# EAGLE design TESTI2C (EAGLE 6.5.0)
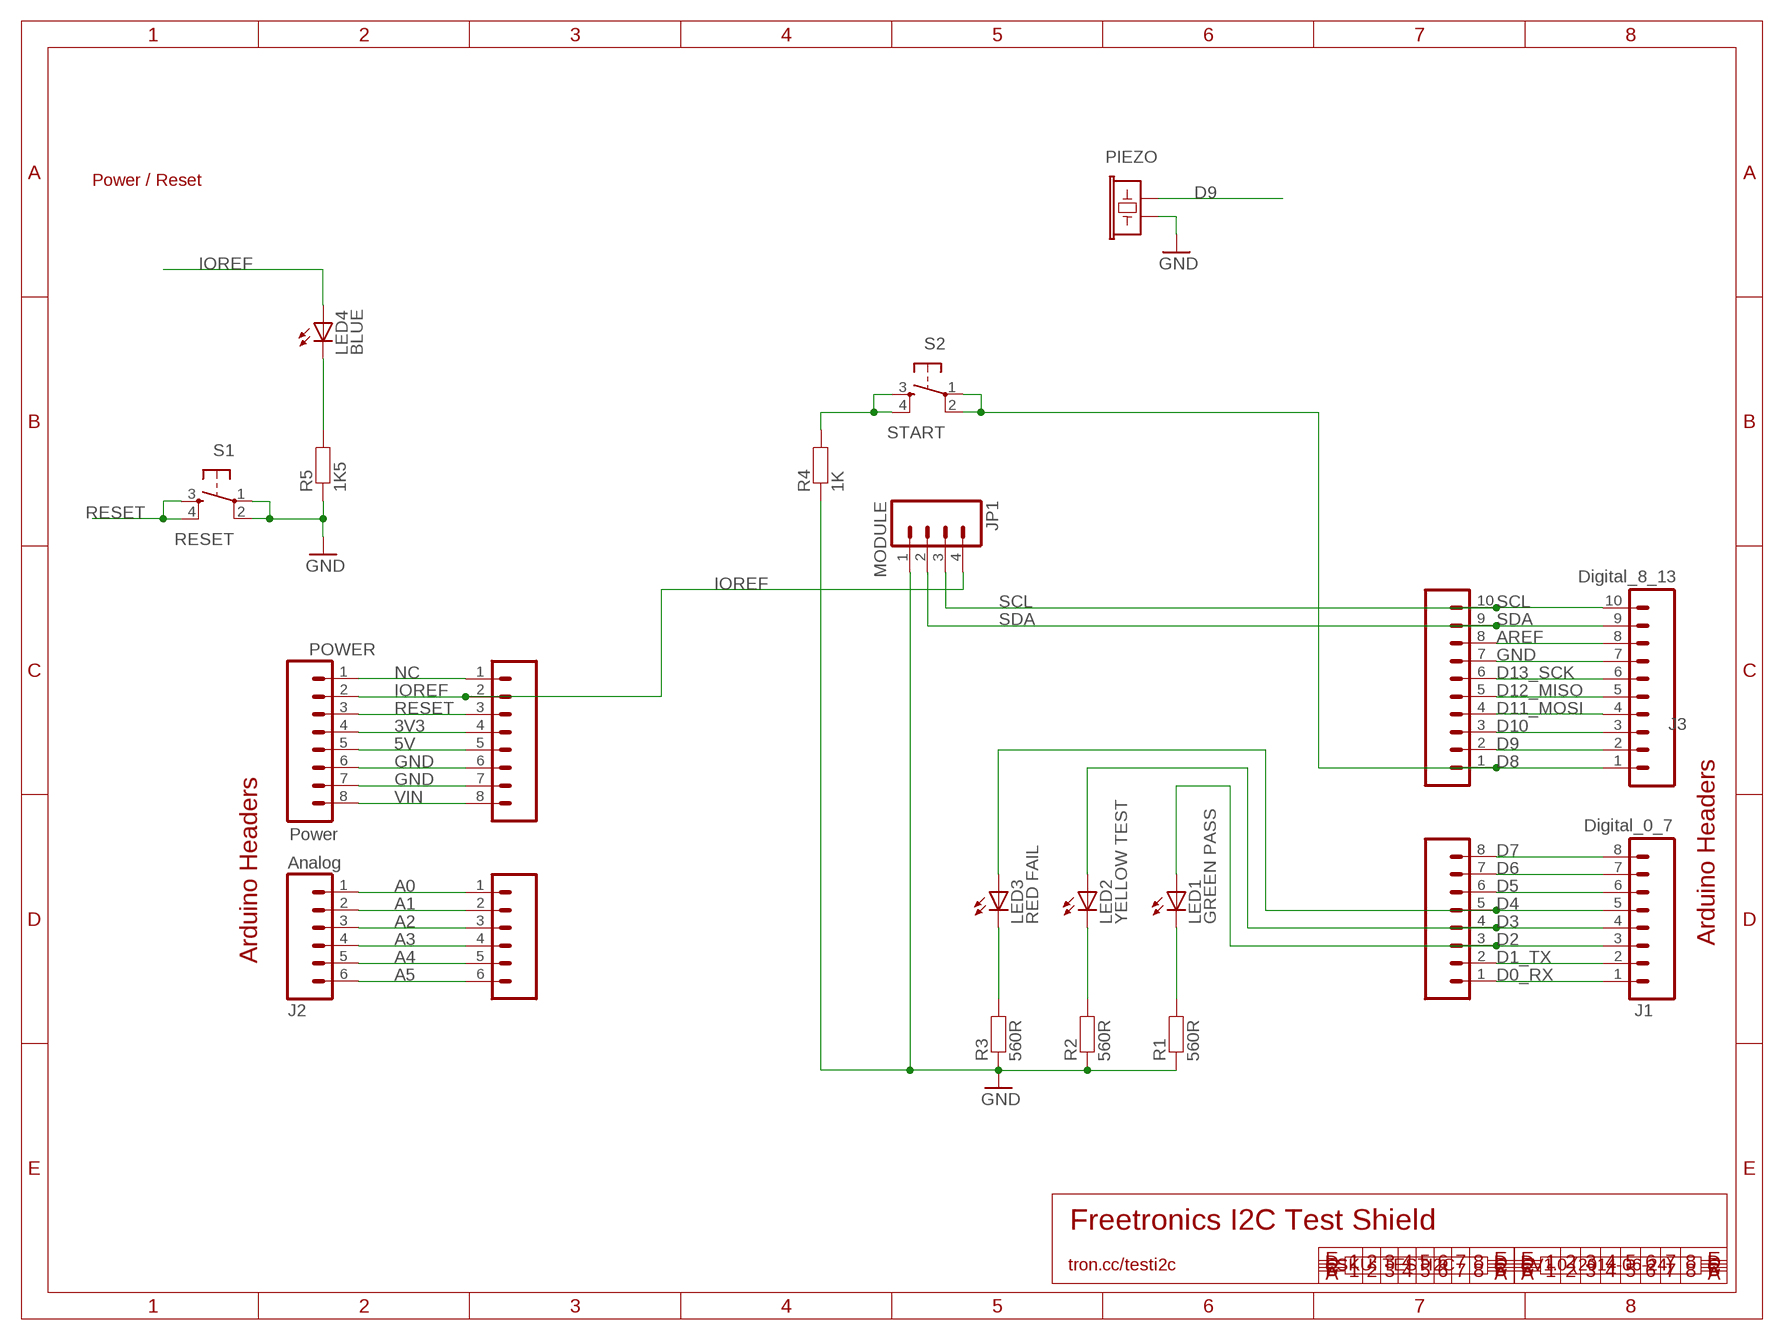
[diagram p0: schematic, sheet 1]

## Parts
J1  Digital_0_7  M08  [1X08]
J2  Analog  M06SIP  [1X06]
J3  Digital_8_13  M100.1  [1X10]
JP1  MODULE  M04PTH  [1X04]
LED1  GREEN PASS  LED0603  [LED-0603]
LED2  YELLOW TEST  LED0603  [LED-0603]
LED3  RED FAIL  LED0603  [LED-0603]
LED4  BLUE  LED0603  [LED-0603]
PIEZO  BUZZERSMD12X12  [BUZZER-12X12-SMT]
POWER  Power  M08  [1X08]
R1  560R  RESISTOR0603  [0603]
R2  560R  RESISTOR0603  [0603]
R3  560R  RESISTOR0603  [0603]
R4  1K  RESISTOR0603  [0603]
R5  1K5  RESISTOR0603  [0603]
S1  RESET  TAC_SWITCHPTH  [TACTILE-PTH]
S2  START  TAC_SWITCHPTH  [TACTILE-PTH]
SL1  Digital_0_7  M08  [1X08]
SL2  Analog  M06SIP  [1X06]
SL3  Digital_8_13  M100.1  [1X10]
SLP  Power  M08  [1X08]

## Nets
3V3: POWER.4 SLP.4
5V: POWER.5 SLP.5
A0: J2.1 SL2.1
A1: J2.2 SL2.2
A2: J2.3 SL2.3
A3: J2.4 SL2.4
A4: J2.5 SL2.5
A5: J2.6 SL2.6
AREF: J3.8 SL3.8
D0_RX: J1.1 SL1.1
D1_TX: J1.2 SL1.2
D2: J1.3 LED1.A SL1.3
D3: J1.4 LED2.A SL1.4
D4: J1.5 LED3.A SL1.5
D5: J1.6 SL1.6
D6: J1.7 SL1.7
D7: J1.8 SL1.8
D8: J3.1 S2.1 S2.2 SL3.1
D9: J3.2 PIEZO.2 SL3.2
D10: J3.3 SL3.3
D11_MOSI: J3.4 SL3.4
D12_MISO: J3.5 SL3.5
D13_SCK: J3.6 SL3.6
GND: J3.7 JP1.1 PIEZO.1 POWER.6 POWER.7 R1.1 R2.1 R3.1 R4.1 R5.1 S1.1 S1.2 SL3.7 SLP.6 SLP.7
IOREF: JP1.4 LED4.A POWER.2 SLP.2
N$1: LED1.C R1.2
N$2: LED2.C R2.2
N$3: LED3.C R3.2
N$4: LED4.C R5.2
N$7: R4.2 S2.3 S2.4
NC: POWER.1 SLP.1
RESET: POWER.3 S1.3 S1.4 SLP.3
SCL: J3.10 JP1.3 SL3.10
SDA: J3.9 JP1.2 SL3.9
VIN: POWER.8 SLP.8

## Notes on the sheet
- Power / Reset
- Arduino Headers
- Arduino Headers
- Freetronics I2C Test Shield
- tron.cc/testi2c | SKU: TESTI2C | V1.0 (2014-06-24)

## Library data of the parts
J1 POWER SL1 SLP = freetronics:M08: Header 8 Standard 8-pin 0.1" header. Use with straight break away headers (SKU : PRT-00116), right angle break away headers (PRT-00553), swiss pins (PRT-00743), machine pins (PRT-00117), and female headers (PRT-00115).
J2 SL2 = freetronics:M06: Header 6 Standard 6-pin 0.1" header. Use with straight break away headers (SKU : PRT-00116), right angle break away headers (PRT-00553), swiss pins (PRT-00743), machine pins (PRT-00117), and female headers (PRT-00115). Molex polarized connector foot print use with SKU : PRT-08094 with associated crimp pins and housings. NOTES ON THE VARIANTS LOCK and LOCK_LONGPADS... This footprint was designed to help hold the alignment of a through-hole component (i.e. 6-pin header) while soldering it into place. You may notice that each hole has been shifted either up or down by 0.005 of an inch from it's more standard position (which is a perfectly straight line). This slight alteration caused the pins (the squares in the middle) to touch the edges of the holes. Because they are alternating, it causes a "brace" to hold the component in place. 0.005 has proven to be the perfect amount of "off-center" position when using our standard breakaway headers. Although looks a little odd when you look at the bare footprint, once you have a header in there, the alteration is very hard to notice. Also, if you push a header all the way into place, it is covered up entirely on the bottom side. This idea of altering the position of holes to aid alignment will be further integrated into the Sparkfun Library for other footprints. It can help hold any component with 3 or more connection pins.
J3 SL3 = freetronics-original:M10: Header 10 Standard 10-pin 0.1" header. Use with straight break away headers (SKU : PRT-00116), right angle break away headers (PRT-00553), swiss pins (PRT-00743), machine pins (PRT-00117), and female headers (PRT-00115).
JP1 = freetronics-master-v1.1:M04: Header 4 Standard 4-pin 0.1" header. Use with straight break away headers (SKU : PRT-00116), right angle break away headers (PRT-00553), swiss pins (PRT-00743), machine pins (PRT-00117), and female headers (PRT-00115). Molex polarized connector foot print use with SKU : PRT-08231 with associated crimp pins and housings.
LED1-LED4 = freetronics-jon:LED: LEDs Standard schematic elements and footprints for 5mm, 3mm, 1206, and 0603 sized LEDs. 5mm - Spark Fun Electronics SKU : COM-00529 (and others)
PIEZO = freetronics-master-v1:BUZZER: Buzzer - Piezo Transducer
R1-R5 = freetronics-jon:RESISTOR: Resistor Basic schematic elements and footprints for 0603, 1206, and PTH 1/10th watt (small) resistors.
S1 S2 = freetronics:TAC_SWITCH: Momentary Switch Button commonly used for reset or general input. Spark Fun Electronics SKU : COM-00097

## Board
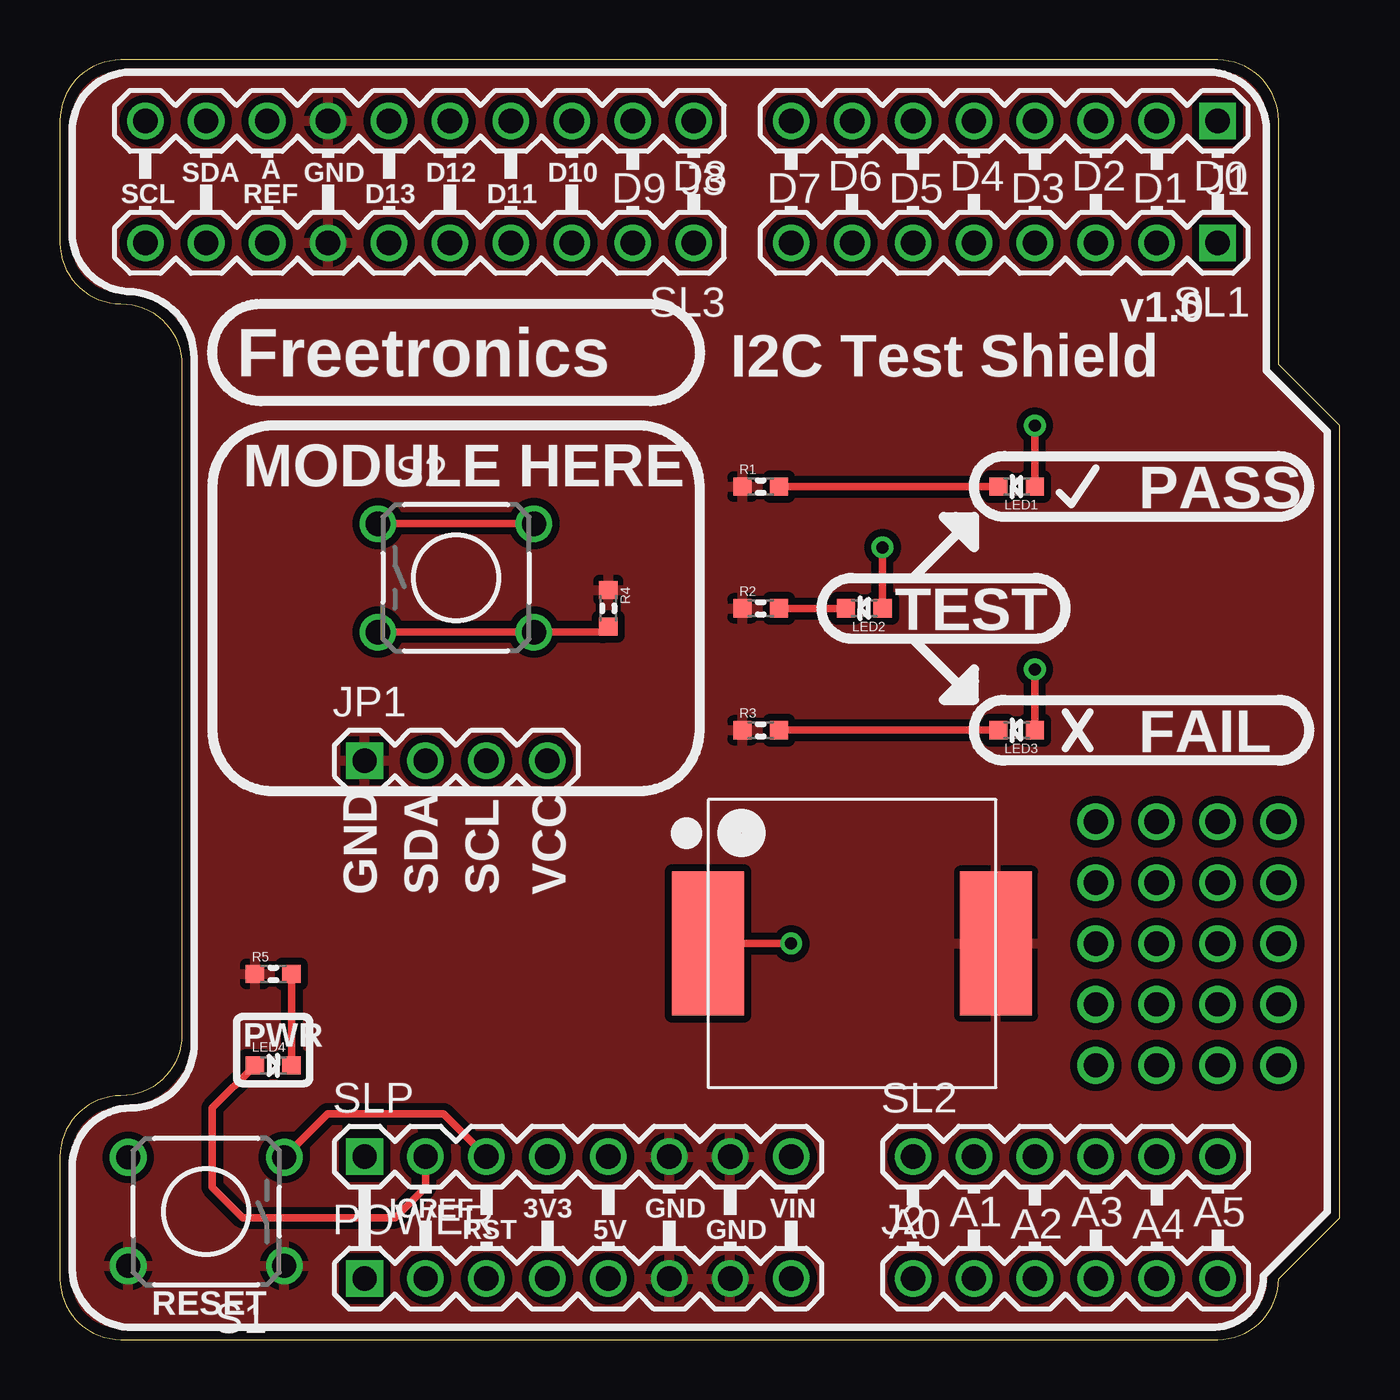
[diagram p1: board, top side]
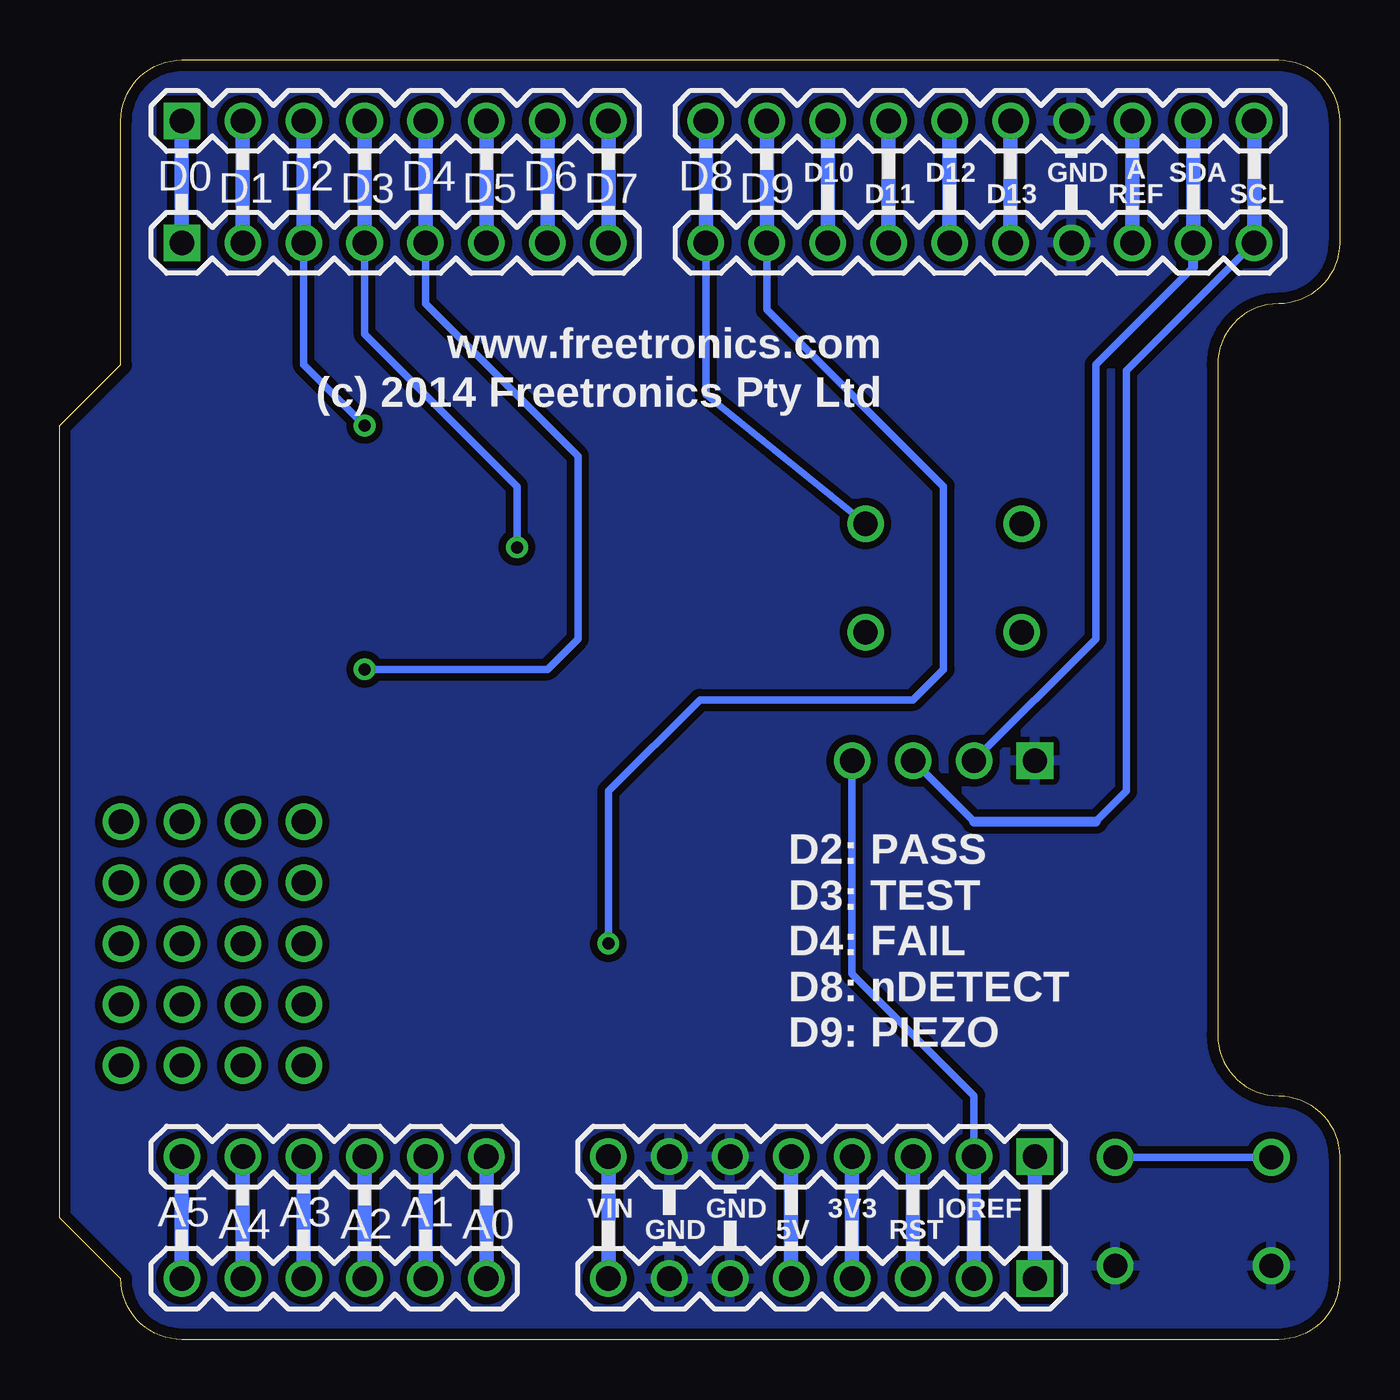
[diagram p2: board, bottom side, seen from below]

Size 53.34 x 53.34 mm. Coordinates in mm from the lower left corner, seen from the top.
Outline: 0,2.54 arc90 2.54,0 48.26,0 arc90 50.8,2.54 53.34,5.08 53.34,38.1 50.8,40.64 50.8,50.8 arc90 48.26,53.34 2.54,53.34 arc90 0,50.8 0,45.72 arc90 2.54,43.18 arc-90 5.08,40.64 5.08,12.7 arc-90 2.54,10.16 arc90 0,7.62 0,2.54
Copper layers (1*16): Top 0.035mm / dielectric 1.5mm / Bottom 0.035mm
Design rules "default *": minimum track width 10mil, minimum drill 24mil, track to track 12mil, track to pad 12mil, pad to pad 12mil, via to via 12mil, smd to smd 8mil, copper to edge 18mil, drill to drill 8mil, minimum pad ring 10mil, minimum via ring 8mil, stop-mask expansion 4mil, vias tented up to drill 0mil, thermal gap 10mil

### Footprints (pad centres in the part's own frame; a part is rotated, then mirrored left to right if it is on the bottom)
1X08 = drill 1.016 square: 1 0,0 | drill 1.016: 2 2.54,0; 3 5.08,0; 4 7.62,0; 5 10.16,0; 6 12.7,0; 7 15.24,0; 8 17.78,0
1X06 = drill 1.016: 1 0,0; 2 2.54,0; 3 5.08,0; 4 7.62,0; 5 10.16,0; 6 12.7,0
1X10 = drill 1.016: 1 0,0; 2 2.54,0; 3 5.08,0; 4 7.62,0; 5 10.16,0; 6 12.7,0; 7 15.24,0; 8 17.78,0; 9 20.32,0; 10 22.86,0
1X04 = drill 1.016 square: 1 0,0 | drill 1.016: 2 2.54,0; 3 5.08,0; 4 7.62,0
LED-0603 = smd 0.762 x 0.762: A -0.762,0; C 0.762,0
BUZZER-12X12-SMT = smd 3 x 6: 1 -6,0; 2 6,0
0603 = smd 0.762 x 0.762: 1 -0.762,0; 2 0.762,0
TACTILE-PTH = drill 1.016: 1 -3.251,2.261; 2 3.251,2.261; 3 -3.251,-2.261; 4 3.251,-2.261

### Placement (x,y rotation side)
J1  48.26,50.8 180 top
J2  35.56,2.54 0 top
J3  26.42,50.8 180 top
JP1  12.7,24.13 0 top
LED1  39.88,35.56 180 top
LED2  33.53,30.48 180 top
LED3  39.88,25.4 180 top
LED4  8.89,11.43 0 top
PIEZO  33.02,16.51 180 top
POWER  12.7,2.54 0 top
R1  29.21,35.56 0 top
R2  29.21,30.48 0 top
R3  29.21,25.4 0 top
R4  22.86,30.48 270 top
R5  8.89,15.24 0 top
S1  6.1,5.33 180 top
S2  16.51,31.75 0 top
SL1  48.26,45.72 180 top
SL2  35.56,7.62 0 top
SL3  26.42,45.72 180 top
SLP  12.7,7.62 0 top

### Tracks (layer width: path | path; a pad name or v marks a point on that pad's centre or on a via)
3V3
  Bottom 0.61: SLP.4 POWER.4
5V
  Bottom 0.61: POWER.5 SLP.5
A0
  Bottom 0.61: J2.1 SL2.1
A1
  Bottom 0.61: J2.2 SL2.2
A2
  Bottom 0.61: J2.3 SL2.3
A3
  Bottom 0.61: J2.4 SL2.4
A4
  Bottom 0.61: J2.5 SL2.5
A5
  Bottom 0.61: J2.6 SL2.6
AREF
  Bottom 0.61: SL3.8 J3.8
D0_RX
  Bottom 0.61: SL1.1 J1.1
D1_TX
  Bottom 0.61: SL1.2 J1.2
D2  (via drill 0.5)
  Top 0.305: LED1.A v40.64,38.1
  Bottom 0.305: v40.64,38.1 43.18,40.64 SL1.3
  Bottom 0.61: SL1.3 J1.3
D3  (via drill 0.5)
  Top 0.305: LED2.A v34.29,33.02
  Bottom 0.305: v34.29,33.02 34.29,35.56 40.64,41.91 SL1.4
  Bottom 0.61: SL1.4 J1.4
D4  (via drill 0.5)
  Top 0.305: LED3.A v40.64,27.94
  Bottom 0.305: v40.64,27.94 33.02,27.94 31.75,29.21 31.75,36.83 38.1,43.18 SL1.5
  Bottom 0.61: SL1.5 J1.5
D5
  Bottom 0.61: SL1.6 J1.6
D6
  Bottom 0.61: SL1.7 J1.7
D7
  Bottom 0.61: SL1.8 J1.8
D8
  Top 0.305: S2.2 S2.1
  Bottom 0.305: S2.2 26.42,39.4 SL3.1
  Bottom 0.61: SL3.1 J3.1
D9  (via drill 0.5)
  Top 0.305: PIEZO.2 v30.48,16.51
  Bottom 0.305: v30.48,16.51 30.48,22.86 26.67,26.67 17.78,26.67 16.51,27.94 16.51,35.56 23.88,42.93 SL3.2
  Bottom 0.61: SL3.2 J3.2
D10
  Bottom 0.61: SL3.3 J3.3
D11_MOSI
  Bottom 0.61: SL3.4 J3.4
D12_MISO
  Bottom 0.61: SL3.5 J3.5
D13_SCK
  Bottom 0.61: SL3.6 J3.6
GND
  pour Bottom: 0,50.8 arc-74 2.54,53.34 48.26,53.34 arc-74 50.8,50.8 50.8,40.64 53.34,38.1 53.34,5.08 50.8,2.54 arc-74 48.26,0 2.54,0 arc-74 0,2.54 0,7.62 arc-90 2.54,10.16 arc90 5.08,12.7 5.08,40.64 arc90 2.54,43.18 arc-90 0,45.72
  pour Top: 0,50.8 arc-74 2.54,53.34 48.26,53.34 arc-74 50.8,50.8 50.8,40.64 53.34,38.1 53.34,5.08 50.8,2.54 arc-74 48.26,0 2.54,0 arc-74 0,2.54 0,7.62 arc-90 2.54,10.16 arc90 5.08,12.7 5.08,40.64 arc90 2.54,43.18 arc-90 0,45.72
IOREF
  Top 0.305: LED4.A 6.35,9.65 6.35,6.35 7.62,5.08 13.97,5.08 15.24,6.35 SLP.2
  Bottom 0.305: SLP.2 15.24,10.16 20.32,15.24 JP1.4
  Bottom 0.61: POWER.2 SLP.2
N$1
  Top 0.305: R1.2 LED1.C
N$2
  Top 0.305: R2.2 LED2.C
N$3
  Top 0.305: R3.2 LED3.C
N$4
  Top 0.305: R5.2 LED4.C
N$7
  Top 0.305: R4.2 22.63,29.49 S2.4 S2.3
N$11  (via drill 1.02)
  other vias: 43.18,21.59
N$12  (via drill 1.02)
  other vias: 45.72,21.59
N$13  (via drill 1.02)
  other vias: 48.26,21.59
N$14  (via drill 1.02)
  other vias: 50.8,21.59
N$15  (via drill 1.02)
  other vias: 50.8,19.05
N$16  (via drill 1.02)
  other vias: 48.26,19.05
N$17  (via drill 1.02)
  other vias: 45.72,19.05
N$18  (via drill 1.02)
  other vias: 43.18,19.05
N$29  (via drill 1.02)
  other vias: 43.18,16.51
N$30  (via drill 1.02)
  other vias: 45.72,16.51
N$31  (via drill 1.02)
  other vias: 48.26,16.51
N$32  (via drill 1.02)
  other vias: 50.8,16.51
N$33  (via drill 1.02)
  other vias: 50.8,13.97
N$34  (via drill 1.02)
  other vias: 48.26,13.97
N$35  (via drill 1.02)
  other vias: 45.72,13.97
N$36  (via drill 1.02)
  other vias: 43.18,13.97
N$46  (via drill 1.02)
  other vias: 50.8,11.43
N$47  (via drill 1.02)
  other vias: 48.26,11.43
N$48  (via drill 1.02)
  other vias: 45.72,11.43
N$49  (via drill 1.02)
  other vias: 43.18,11.43
NC
  Bottom 0.61: POWER.1 SLP.1
RESET
  Top 0.305: SLP.3 16,9.4 11.15,9.4 S1.3
  Bottom 0.305: S1.4 S1.3
  Bottom 0.61: POWER.3 SLP.3 | S1.3 9.37,7.59
SCL
  Bottom 0.305: JP1.3 15.24,21.59 | 10.16,21.59 8.89,22.86 8.89,40.39 SL3.10
  Bottom 0.406: 15.24,21.59 10.16,21.59
  Bottom 0.61: J3.10 SL3.10
SDA
  Bottom 0.305: 6.1,44.7 10.16,40.64 10.16,29.21 JP1.2
  Bottom 0.406: 6.1,44.7 SL3.9
  Bottom 0.61: J3.9 SL3.9
VIN
  Bottom 0.61: SLP.8 POWER.8

### Text on the board
tPlace: SDA | A | GND | D12 | D10 | D8 | D6 | D4 | D2 | D0 | SCL | REF | D13 | D11 | D9 | D7 | D5 | D3 | D1 | v1.0 | Freetronics | I2C Test Shield | MODULE HERE | PASS | TEST | FAIL | GND | SDA | SCL | VCC | PWR | IOREF | 3V3 | GND | VIN | A1 | A3 | A5 | RST | 5V | GND | A0 | A2 | A4 | RESET
bPlace: SDA | A | GND | D12 | D10 | D8 | D6 | D4 | D2 | D0 | SCL | REF | D13 | D11 | D9 | D7 | D5 | D3 | D1 | www.freetronics.com | (c) 2014 Freetronics Pty Ltd | D2: PASS / D3: TEST / D4: FAIL / D8: nDETECT / D9: PIEZO | IOREF | 3V3 | GND | VIN | A1 | A3 | A5 | RST | 5V | GND | A0 | A2 | A4
tDocu: K | A | K | A | K | A